# Altium schematic sheet Pit-RFD.SchDoc
size A
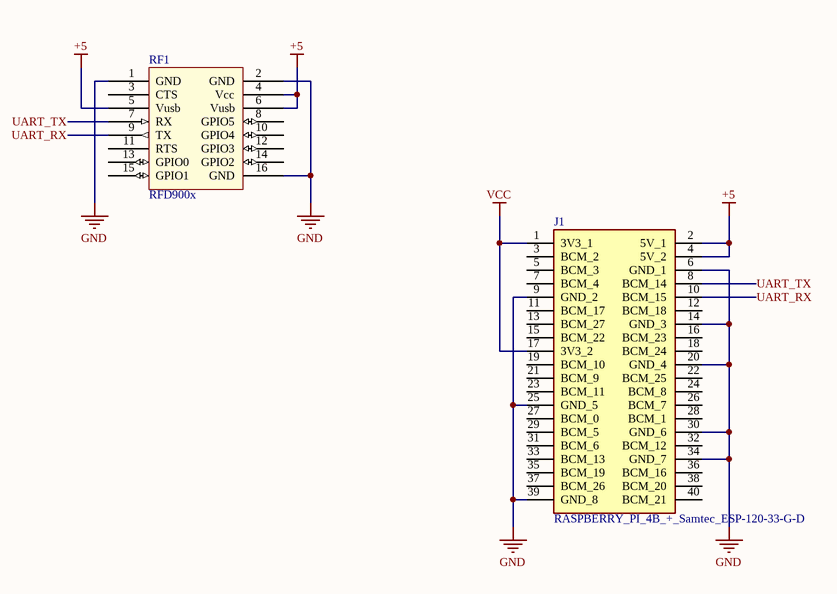
[diagram p0: Pit-RFD.SchDoc]

## Parts
J1  RASPBERRY_PI_4B_+_Samtec_ESP-120-33-G-D  [RASPBERRYPI4B4GB]
RF1  RFD900x  [RFD900X_HS_U]

## Nets
+5: J1.2(5V_1) J1.4(5V_2) RF1.4(Vcc) RF1.5(Vusb) RF1.6(Vusb)
GND: J1.6(GND_1) J1.9(GND_2) J1.14(GND_3) J1.20(GND_4) J1.25(GND_5) J1.30(GND_6) J1.34(GND_7) J1.39(GND_8) RF1.1(GND) RF1.2(GND) RF1.16(GND)
VCC: J1.1(3V3_1) J1.17(3V3_2)
UART_RX: J1.10(BCM_15) RF1.9(TX)
UART_TX: J1.8(BCM_14) RF1.7(RX)

Not connected (* = marked no-connect by the designer): J1 3(BCM_2) 5(BCM_3) 7(BCM_4) 11(BCM_17) 12(BCM_18) 13(BCM_27) 15(BCM_22) 16(BCM_23) 18(BCM_24) 19(BCM_10) 21(BCM_9) 22(BCM_25) 23(BCM_11) 24(BCM_8) 26(BCM_7) 27(BCM_0) 28(BCM_1) 29(BCM_5) 31(BCM_6) 32(BCM_12) 33(BCM_13) 35(BCM_19) 36(BCM_16) 37(BCM_26) 38(BCM_20) 40(BCM_21); RF1 3(CTS) 8(GPIO5) 10(GPIO4) 11(RTS) 12(GPIO3) 13(GPIO0) 14(GPIO2) 15(GPIO1)

## Library data of the parts
J1 = RASPBERRY_PI_4B_+_Samtec_ESP-120-33-G-D: Connector; Manufacturer_Name: RASPBERRY-PI; Manufacturer_Part_Number: RASPBERRY PI 4B + Samtec ESP-120-33-G-D; Datasheet Link: https://www.raspberrypi.org/documentation/hardware/raspberrypi/mechanical/rpi_MECH_4b_4p0.pdf; Height: 24.3mm; Arrow Part Number: RASPBERRY PI 4B + Samtec ESP-120-33-G-D